# EasyEDA Pro project ProPrj_火灾检测装置_2025-07-03.epro

# Schematic Schematic1
Board Name: Board1; Create Date: 2025-06-30; Page Name: P1; Project Name: 火灾检测装置; Schematic Name: Schematic1; Update Date: 2025-07-02; Company: 嘉立创EDA; Page Size: A4; Version: V1.0
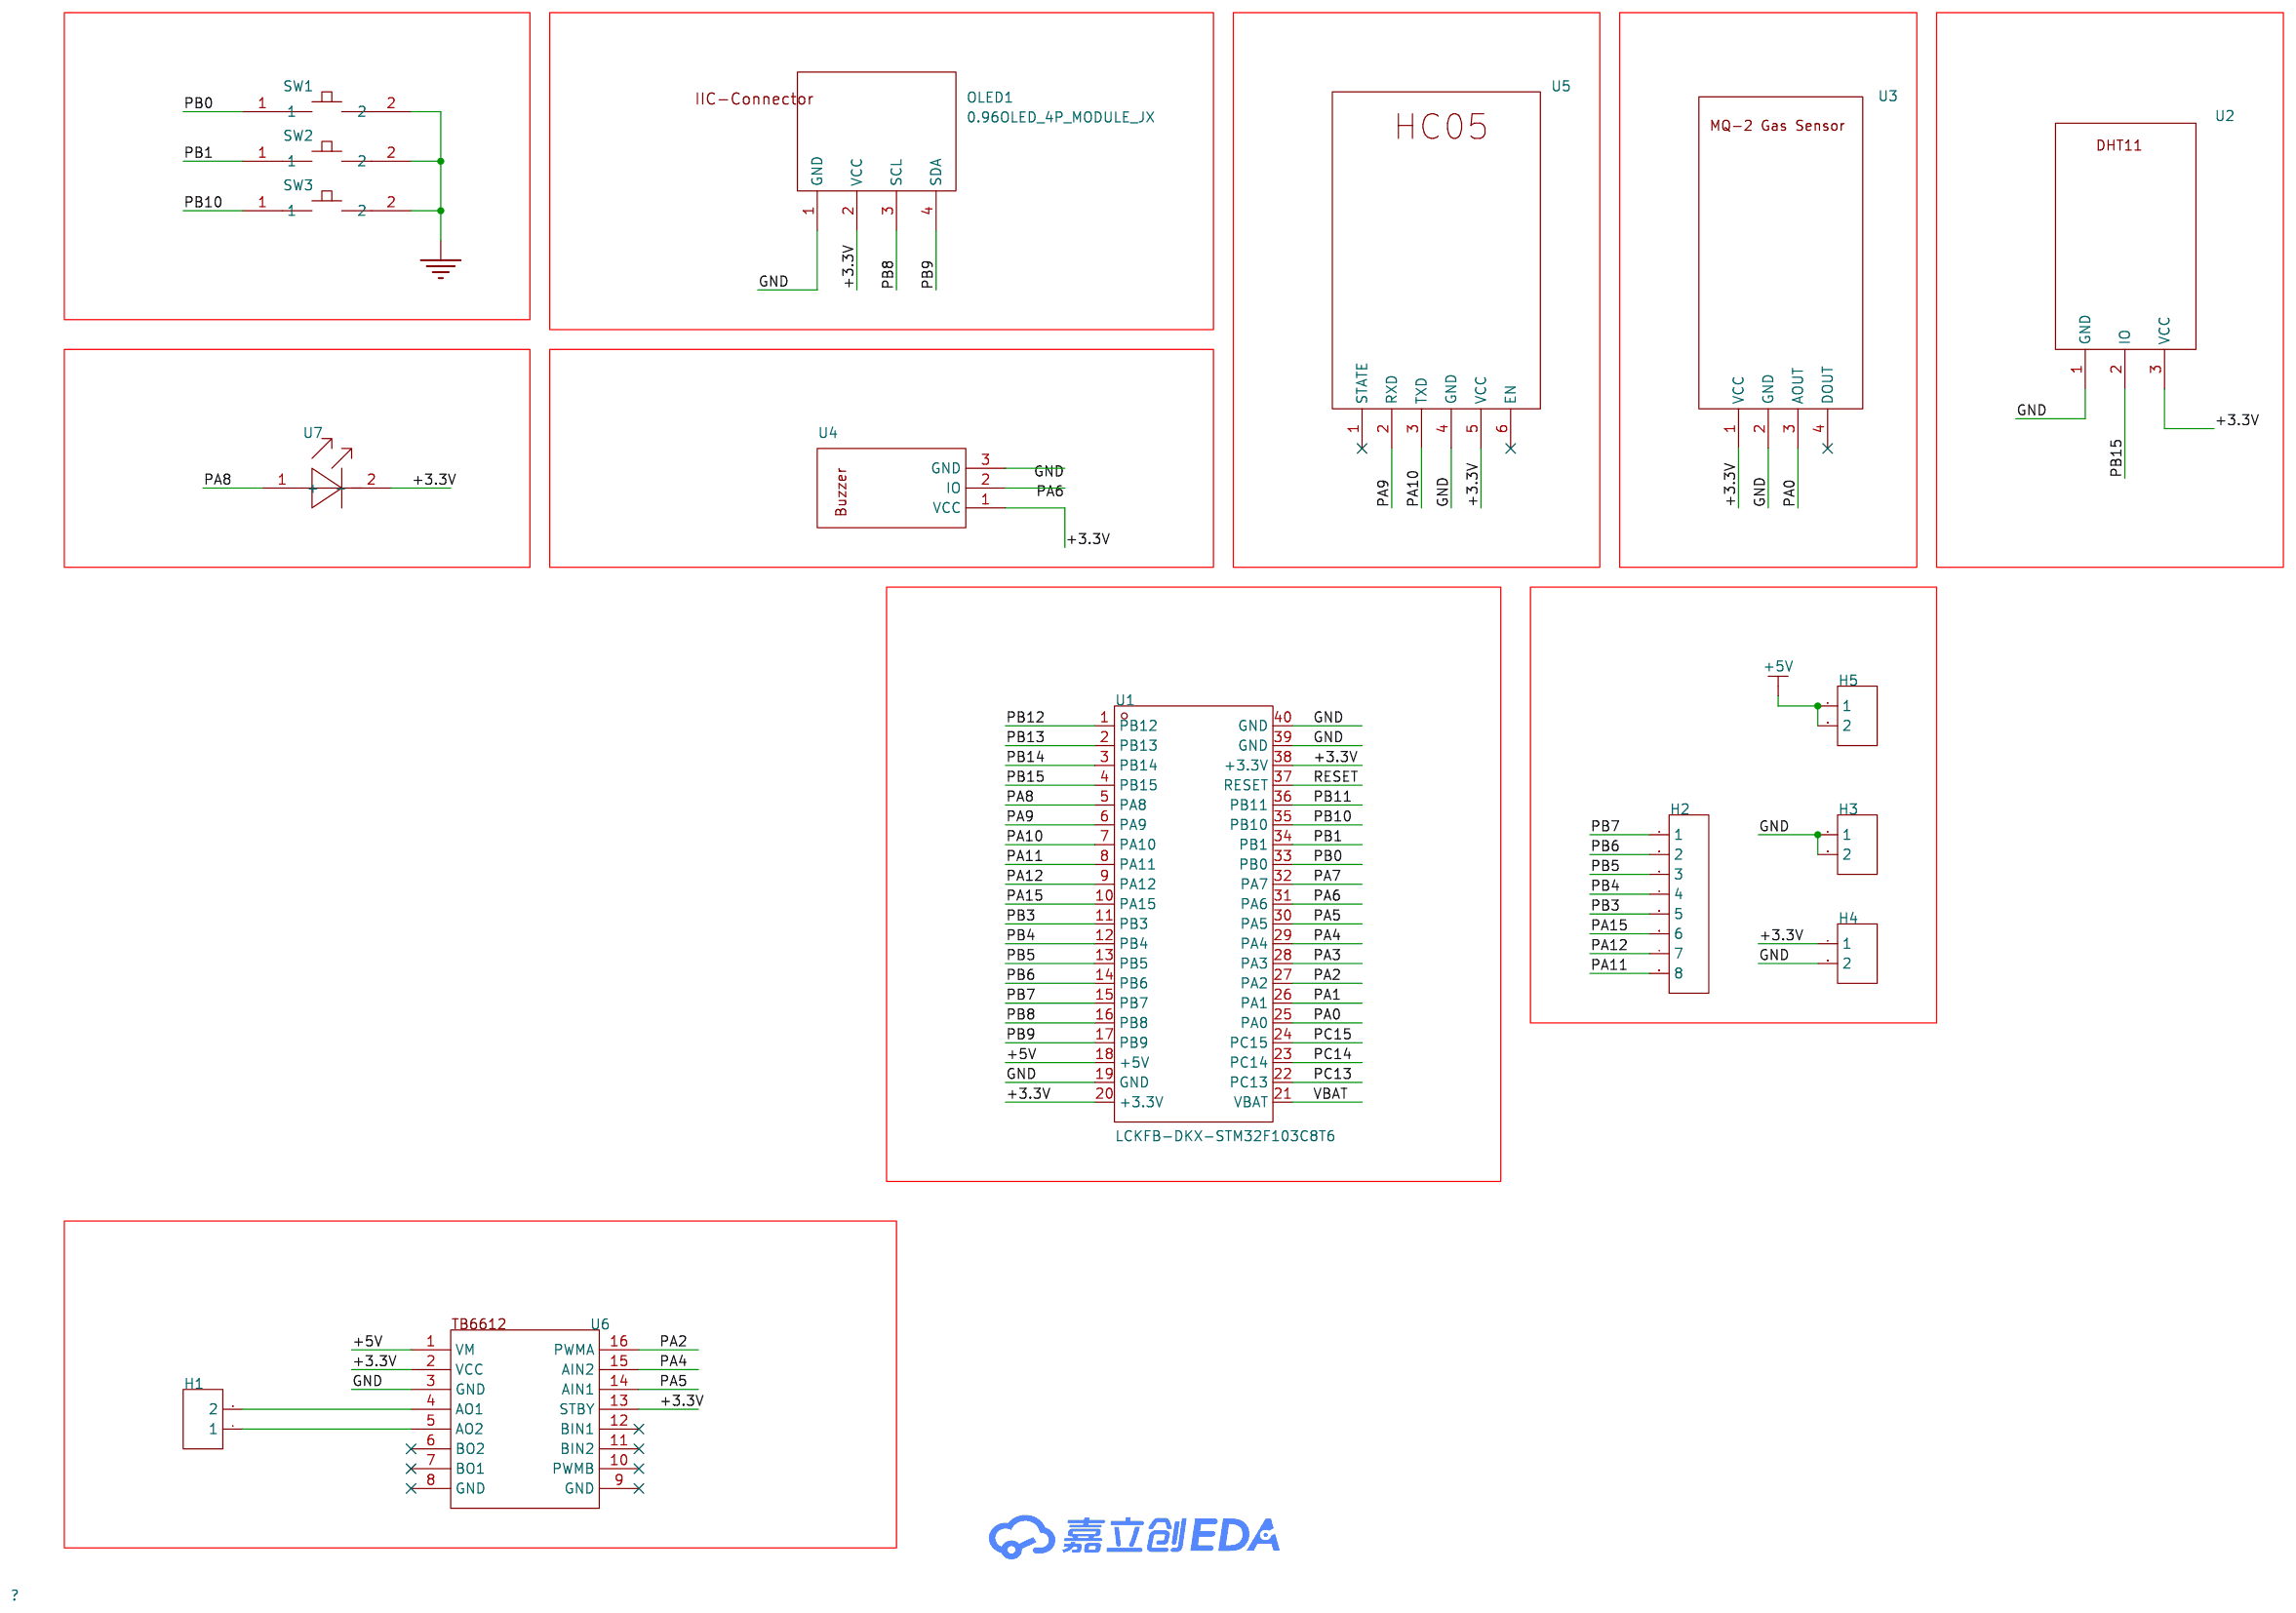
[diagram p0: schematic sheet]

## Parts
H1  -  [HDR-TH_2P-P2.54-V-F]
H2  -  [HDR-TH_8P-P2.54-V-F-1]
H3  -  [HDR-TH_2P-P2.54-V-F]
H4  -  [HDR-TH_2P-P2.54-V-F]
H5  -  [HDR-TH_2P-P2.54-V-F]
OLED1  0.96OLED_4P_MODULE_JX  [0.96OLED_4P]
SW1  -  [按键]
SW2  -  [按键]
SW3  -  [按键]
U1  LCKFB-DKX-STM32F103C8T6  [CONN-TH_L53.3-W22.9_STM32F103C8T6-CARD]
U2  -  [DHT11.]
U3  -  [MQ-2 Gas Sensor]
U4  -  [Buzzer]
U5  -  [HC05]
U6  -  [TB6612]
U7  -  [LED]

## Library data of the parts
H1 H3-H5 = HDR-F_2.54_1x2P: Supplier Part: C49661; Supplier Footprint: 插件
H2 = HDR-F_2.54_1x8P: Supplier Part: C27438; Supplier Footprint: 插件
OLED1 = 0.96OLED_4P_MODULE_JX: Supplier Part: C9900004566; Supplier Footprint: 插件; JLCPCB Part Class: 扩展库; Supplier: LCSC
SW1-SW3 = 按键
U1 = LCKFB-DKX-STM32F103C8T6: LCSC Part Name: 立创·地阔星-STM32F103C8T6开发板; Supplier Part: C22396880; Manufacturer: 立创开发板; JLCPCB Part Class: 扩展库; Datasheet: https://atta.szlcsc.com/upload/public/pdf/source/20241206/D7467B743BEDB0C7B9E08FA0EBB7E773.pdf; Supplier: LCSC
U2 = DHT11
U3 = MQ-2 Gas Sensor
U4 = Buzzer
U5 = HC05
U6 = TB6612
U7 = LED

## Nets
+3.3V: H4.1 OLED1.2(VCC) U1.20(+3.3V) U1.38(+3.3V) U2.3(VCC) U3.1(VCC) U4.1(VCC) U5.5(VCC) U6.2(VCC) U6.13(STBY) U7.2(-)
+5V: H5.1 H5.2 U1.18(+5V) U6.1(VM)
GND: H3.1 H3.2 H4.2 OLED1.1(GND) SW1.2 SW2.2 SW3.2 U1.19(GND) U1.39(GND) U1.40(GND) U2.1(GND) U3.2(GND) U4.3(GND) U5.4(GND) U6.3(GND)
VBAT: U1.21(VBAT)
PA0: U1.25(PA0) U3.3(AOUT)
PA1: U1.26(PA1)
PA2: U1.27(PA2) U6.16(PWMA)
PA3: U1.28(PA3)
PA4: U1.29(PA4) U6.15(AIN2)
PA5: U1.30(PA5) U6.14(AIN1)
PA6: U1.31(PA6) U4.2(IO)
PA7: U1.32(PA7)
PA8: U1.5(PA8) U7.1(+)
PA9: U1.6(PA9) U5.2(RXD)
PA10: U1.7(PA10) U5.3(TXD)
PA11: H2.8 U1.8(PA11)
PA12: H2.7 U1.9(PA12)
PA15: H2.6 U1.10(PA15)
PB0: SW1.1 U1.33(PB0)
PB1: SW2.1 U1.34(PB1)
PB3: H2.5 U1.11(PB3)
PB4: H2.4 U1.12(PB4)
PB5: H2.3 U1.13(PB5)
PB6: H2.2 U1.14(PB6)
PB7: H2.1 U1.15(PB7)
PB8: OLED1.3(SCL) U1.16(PB8)
PB9: OLED1.4(SDA) U1.17(PB9)
PB10: SW3.1 U1.35(PB10)
PB11: U1.36(PB11)
PB12: U1.1(PB12)
PB13: U1.2(PB13)
PB14: U1.3(PB14)
PB15: U1.4(PB15) U2.2(IO)
PC13: U1.22(PC13)
PC14: U1.23(PC14)
PC15: U1.24(PC15)
RESET: U1.37(RESET)
$1N2776: H1.2 U6.4(AO1)
$1N2780: H1.1 U6.5(AO2)

Not connected (* = marked no-connect by the designer): U3 4(DOUT)*; U5 1(STATE)* 6(EN)*; U6 6(BO2)* 7(BO1)* 8(GND)* 9(GND)* 10(PWMB)* 11(BIN2)* 12(BIN1)*

# Board PCB1
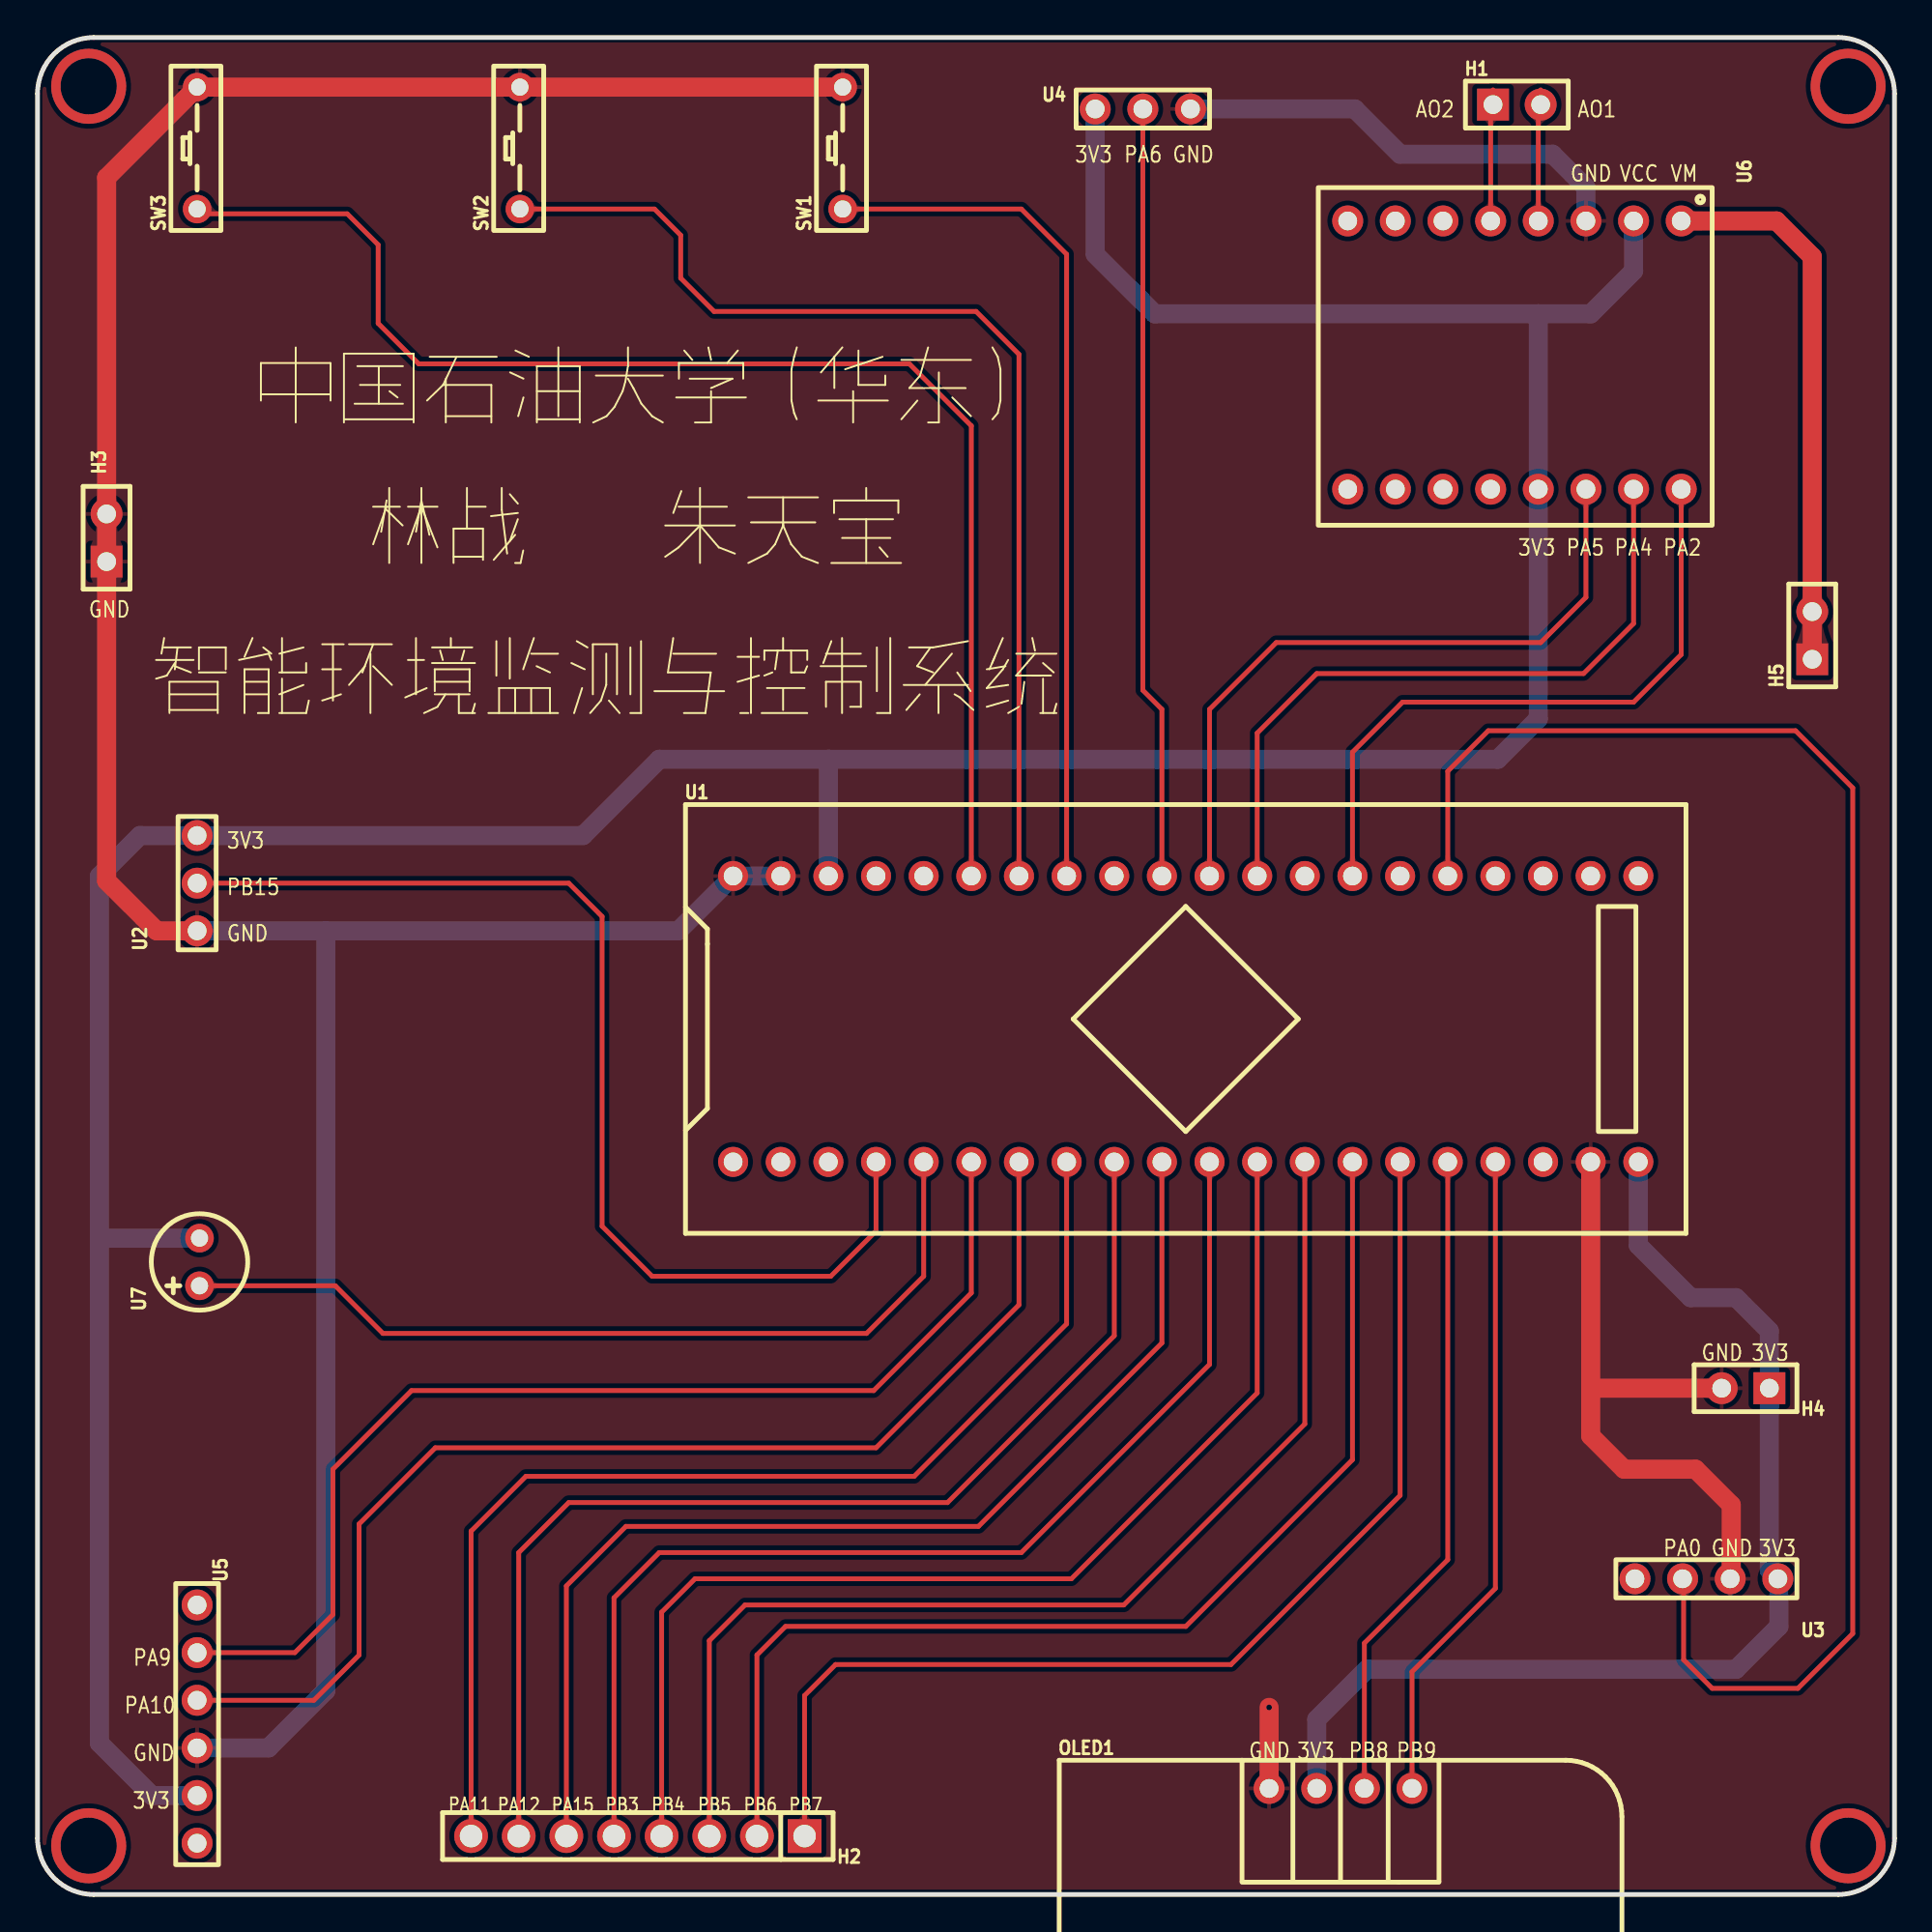
[diagram p1: board, top side]
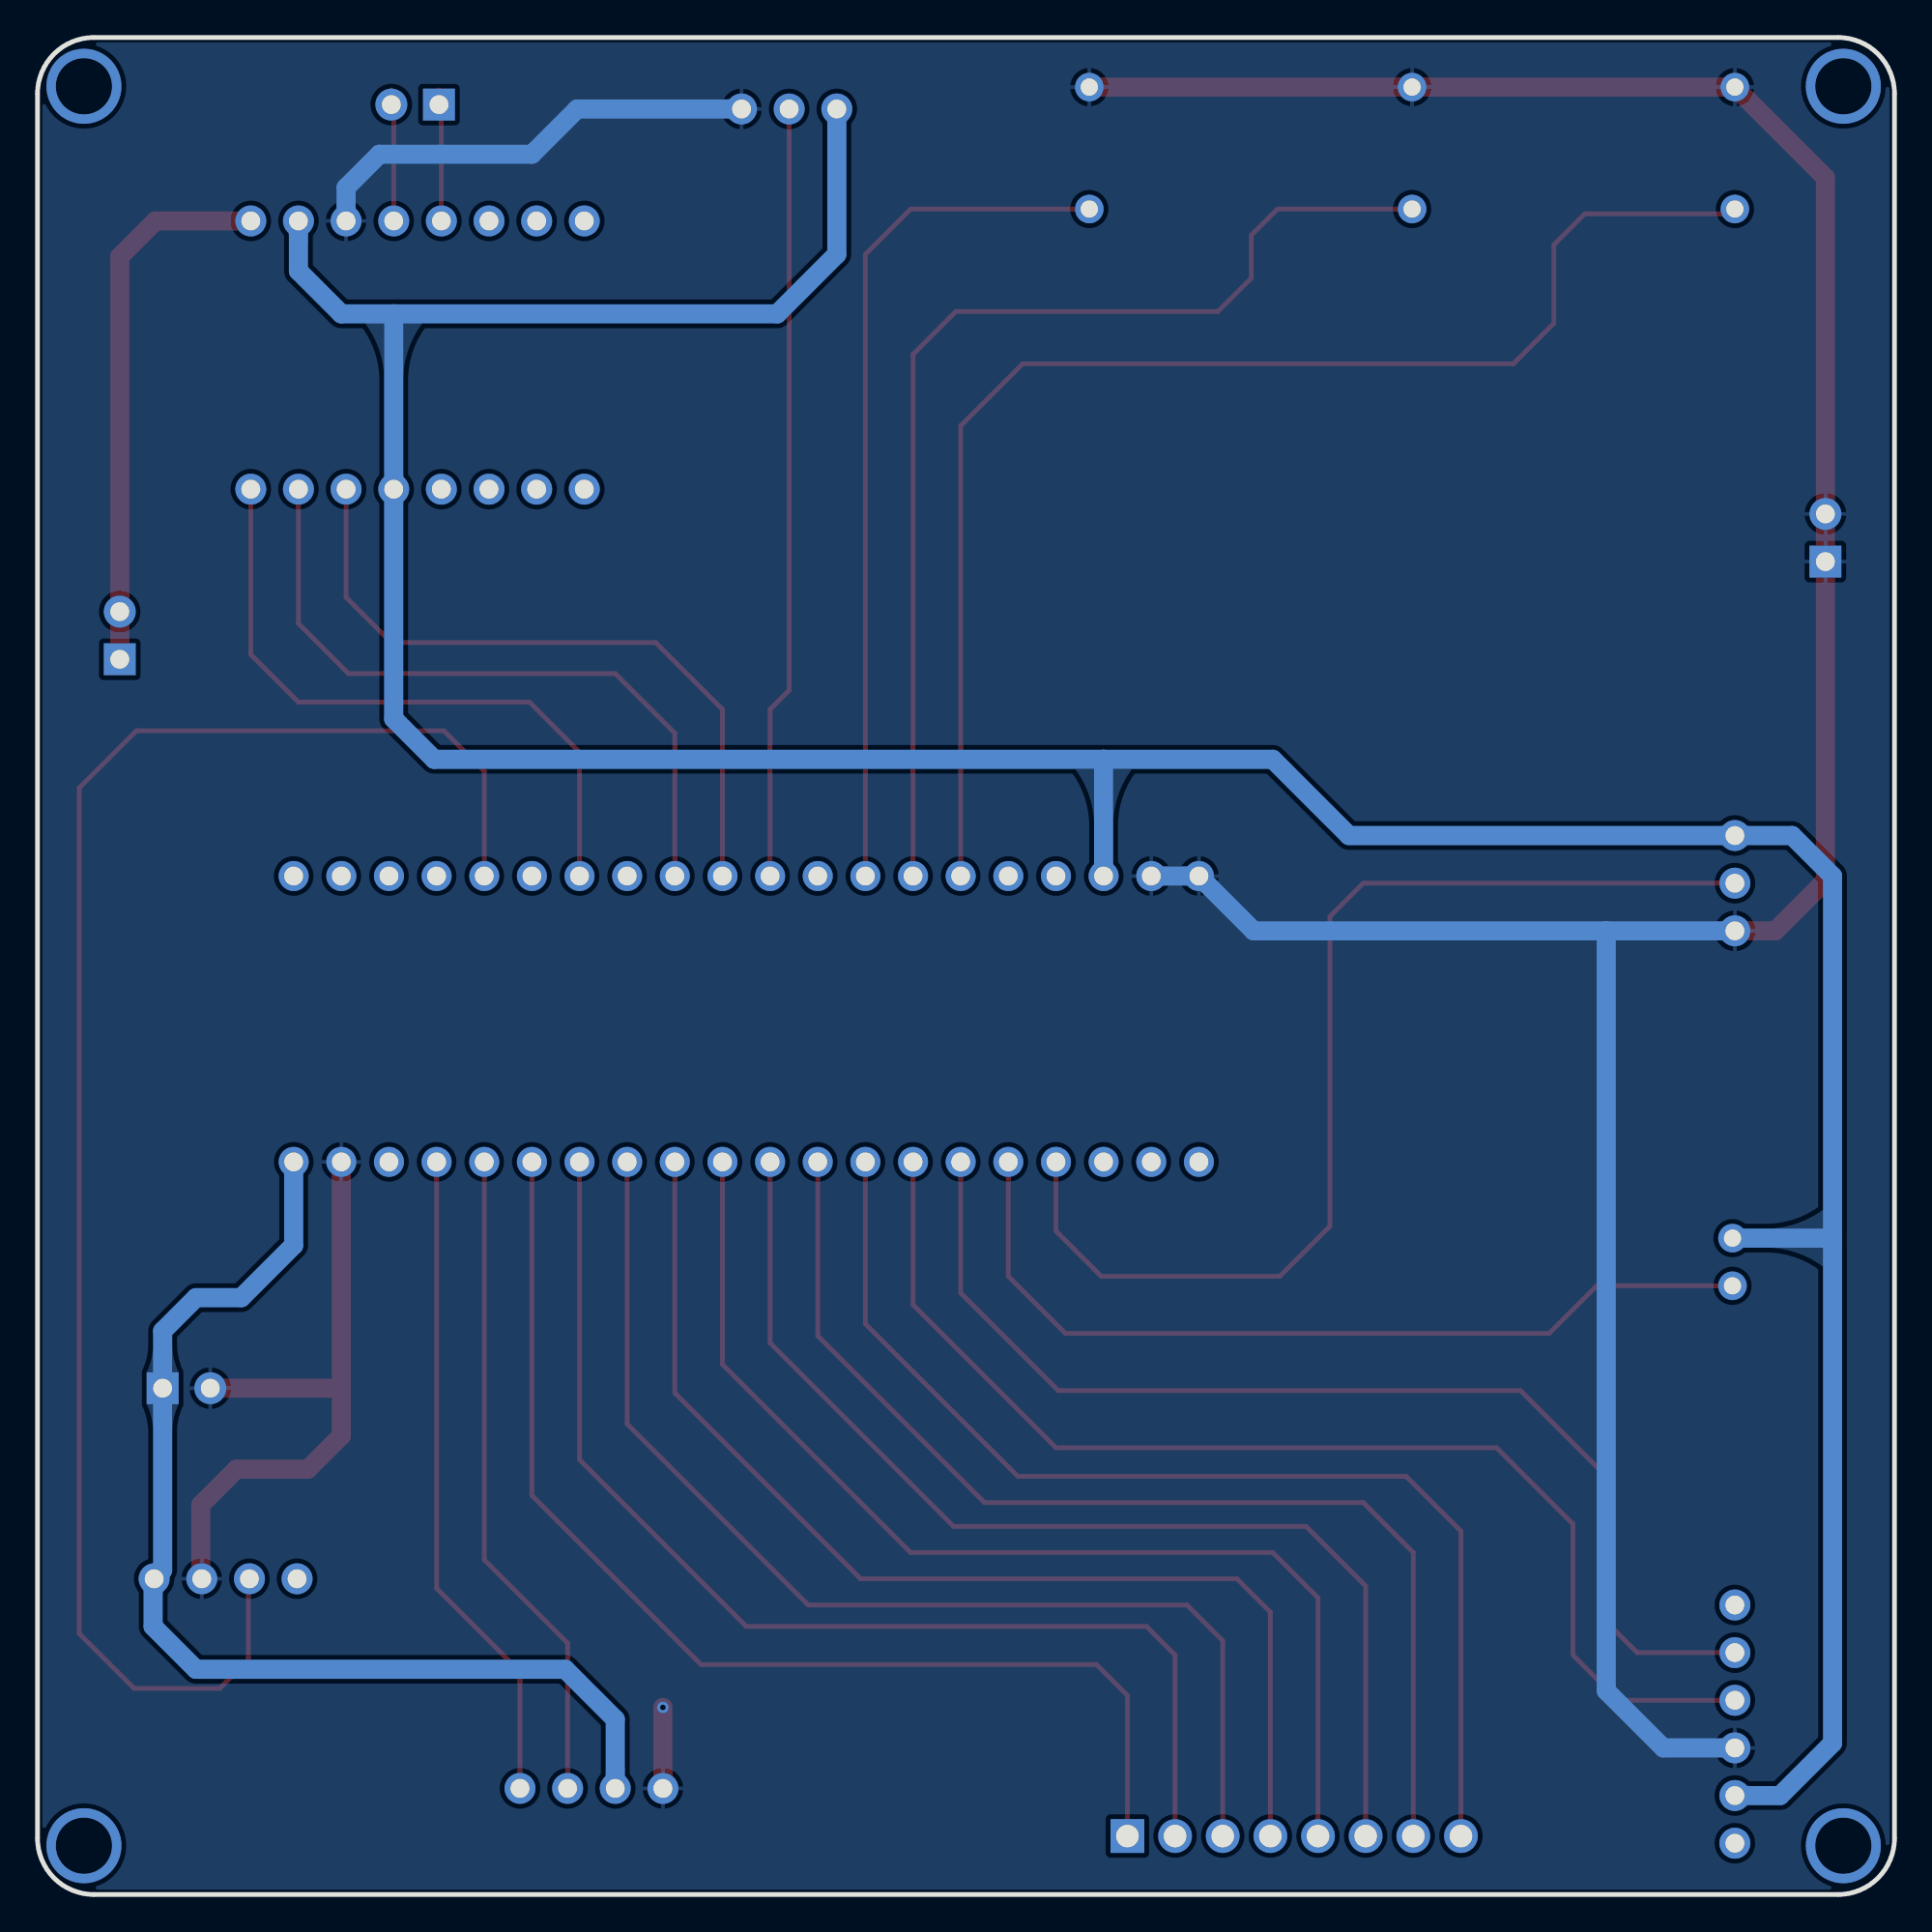
[diagram p2: board, bottom side, seen from below]

Outline 99 x 99 mm; copper layers: Top Layer, Bottom Layer. Coordinates in mm from the lower left corner of the outline.
Outline path: 0,96 0,3 arc(0.88,0.88) 3,0 96,0 arc(98.12,0.88) 99,3 99,96 arc(98.12,98.12) 96,99 3,99 arc(0.88,98.12) 0,96
Stack: Top Layer 0.035mm / Dielectric1 1.51mm FR4 er 4.5 / Bottom Layer 0.035mm

## Design rules (mm)
template: JLCPCB Capability(Two Layers Board)
spacing copperThickness1oz (default): track to track 0.102, other pairs 0.152 to 0.3
spacing copperThickness2oz: track to track 0.203, other pairs 0.152 to 0.3
track width copperThickness1oz (default): min 0.127, default 0.254, max 2.54
track width copperThickness2oz: min 0.203, default 0.254, max 2.54
differential pair differentialPair (default): width min 0.127, default 0.254, max 2.54; gap min 0.152, default 0.152
via viaSize (default): diameter min 0.5, default 0.61, max 10; hole min 0.3, default 0.305, max 6.3

## Placement (name value [footprint] x y rotation side)
H1  -  [HDR-TH_2P-P2.54-V-F]  78.87 95.42 0 top
H2  -  [HDR-TH_8P-P2.54-V-F-1]  32 3.12 180 top
H3  -  [HDR-TH_2P-P2.54-V-F]  3.68 72.33 90 top
H4  -  [HDR-TH_2P-P2.54-V-F]  91.06 26.99 180 top
H5  -  [HDR-TH_2P-P2.54-V-F]  94.61 67.12 90 top
OLED1  0.96OLED_4P_MODULE_JX  [0.96OLED_4P]  69.47 5.66 0 top
SW1  -  [按键]  42.93 89.86 90 top
SW2  -  [按键]  25.72 89.86 90 top
SW3  -  [按键]  8.51 89.86 90 top
U1  LCKFB-DKX-STM32F103C8T6  [CONN-TH_L53.3-W22.9_STM32F103C8T6-CARD]  61.21 46.68 0 top
U2  -  [DHT11.]  8.51 51.38 90 top
U3  -  [MQ-2 Gas Sensor]  92.78 16.83 180 top
U4  -  [Buzzer]  56.39 95.19 0 top
U5  -  [HC05]  8.51 15.43 270 top
U6  -  [TB6612]  87.63 89.22 270 top
U7  -  [LED]  8.64 32.45 90 top

## Footprints (pads in the part's own frame, mm; a bottom-side part is the same pattern mirrored in y, then rotated)
0.96OLED_4P
  round 1.65 hole 1: 1(-3.81,-0.002) 2(-1.27,0.002) 3(1.27,0.002) 4(3.81,0.002)
Buzzer
  round 1.65 hole 1: 1(0,0) 2(2.54,0) 3(5.08,0)
CONN-TH_L53.3-W22.9_STM32F103C8T6-CARD
  round 1.6 hole 1: 1(-24.13,-7.62) 2(-21.59,-7.62) 3(-19.05,-7.62) 4(-16.51,-7.62) 5(-13.97,-7.62) 6(-11.43,-7.62) 7(-8.89,-7.62) 8(-6.35,-7.62) 9(-3.81,-7.62) 10(-1.27,-7.62) 11(1.27,-7.62) 12(3.81,-7.62) 13(6.35,-7.62) 14(8.89,-7.62) 15(11.43,-7.62) 16(13.97,-7.62) 17(16.51,-7.62) 18(19.05,-7.62) 19(21.59,-7.62) 20(24.13,-7.62) 21(24.13,7.62) 22(21.59,7.62) 23(19.05,7.62) 24(16.51,7.62) 25(13.97,7.62) 26(11.43,7.62) 27(8.89,7.62) 28(6.35,7.62) 29(3.81,7.62) 30(1.27,7.62) 31(-1.27,7.62) 32(-3.81,7.62) 33(-6.35,7.62) 34(-8.89,7.62) 35(-11.43,7.62) 36(-13.97,7.62) 37(-16.51,7.62) 38(-19.05,7.62) 39(-21.59,7.62) 40(-24.13,7.62)
DHT11.
  round 1.65 hole 1.001: 1(0,0) 2(2.54,0) 3(5.08,0)
HC05
  round 1.65 hole 1: 1(0,0) 2(2.54,0) 3(5.08,0) 4(7.62,0) 5(10.16,0) 6(12.7,0)
HDR-TH_2P-P2.54-V-F
  rect 1.7x1.7 hole 1: 1(-1.27,0)
  round 1.7 hole 1: 2(1.27,0)
HDR-TH_8P-P2.54-V-F-1
  rect 1.8x1.8 hole 1.2: 1(-8.89,0)
  round 1.8 hole 1.2: 2(-6.35,0) 3(-3.81,0) 4(-1.27,0) 5(1.27,0) 6(3.81,0) 7(6.35,0) 8(8.89,0)
LED
  round 1.524 hole 0.914x0.6: 1(0,0) 2(2.54,0)
MQ-2 Gas Sensor
  round 1.65 hole 1: 1(0,0) 2(2.54,0) 3(5.08,0) 4(7.62,0)
TB6612
  round 1.65 hole 1: 1(0,0) 2(0,-2.54) 3(0,-5.08) 4(0,-7.62) 5(0,-10.16) 6(0,-12.7) 7(0,-15.24) 8(0,-17.78) 9(14.3,-17.78) 10(14.3,-15.24) 11(14.3,-12.7) 12(14.3,-10.16) 13(14.3,-7.62) 14(14.3,-5.08) 15(14.3,-2.54) 16(14.3,0)
按键
  round 1.524 hole 0.914x0.8: 1(0,0) 2(6.5,0)

## Nets
As in the schematic.

Pads without a net: U3 4; U5 1 6; U6 6 7 8 9 10 11 12

## Via types
v1: diameter 4, hole 3, Top Layer to Bottom Layer, 4 vias
v2: diameter 0.61, hole 0.305, Top Layer to Bottom Layer, 1 via

## Routing (per net, layer and track width the routed paths; a pad name or vN(x,y) marks a point on that pad's centre or on a via; arc(x,y) is an arc through that point)
+3.3V: length 267
  Bottom Layer w1.016: U4.1 56.39,87.44 59.56,84.27 80.01,84.27 ; 42.16,60.52 77.85,60.52 80.01,62.68 80.01,84.27 ; 42.16,60.52 33.15,60.52 29.08,56.45 U2.3 5.46,56.45 3.3,54.3 3.3,34.86 ; 42.16,60.52 U1.38 ; U5.5 6.1,5.27 3.3,8.07 3.3,34.86 ; 3.3,34.86 3.43,34.99 U7.2 ; 80.01,84.27 82.8,84.27 85.09,86.55 U6.2 ; U1.20 85.34,34.61 88.14,31.82 90.55,31.82 92.33,30.04 H4.1 92.33,17.28 U3.1 92.84,16.78 92.84,14.29 90.55,12 70.87,12 68.2,9.34 OLED1.2
+5V: length 29.2
  Top Layer w1.016: 94.61,65.85 H5.2 94.61,87.32 92.71,89.22 U6.1
GND: length 229.1
  Top Layer w1.016: H4.2 82.86,26.99 82.8,27.05 ; 82.8,27.05 U1.19 ; 82.8,27.05 82.8,24.45 84.58,22.67 88.39,22.67 90.3,20.77 90.3,16.88 U3.2 ; SW1.2 SW2.2 SW3.2 3.68,91.53 H3.2 H3.1 3.68,54.04 6.35,51.38 U2.1 ; OLED1.1 v2(65.66,9.97)
  Bottom Layer w1.016: U2.1 15.37,51.38 ; 15.37,51.38 15.37,10.86 12.32,7.81 U5.4 ; 15.37,51.38 34.16,51.38 U1.40 U1.39 ; 82.55,89.22 82.55,91 80.77,92.78 72.64,92.78 70.23,95.19 U4.3
(no net):
  vias: v1(2.73,96.4) v1(2.73,2.6) v1(96.53,96.4) v1(96.53,2.6)
PA0: length 89.7
  Top Layer w0.254: 87.76,16.88 87.76,12.51 89.28,10.99 93.85,10.99 96.77,13.91 96.77,59 93.73,62.04 77.34,62.04 75.18,59.88 U1.25 ; 87.76,16.88 87.76,16.9 ; 87.76,16.88 U3.3
PA2: length 35.1
  Top Layer w0.254: U1.27 70.1,60.9 72.77,63.57 85.09,63.57 87.63,66.11 U6.16
PA4: length 37.3
  Top Layer w0.254: U6.15 85.09,67.76 82.42,65.09 68.2,65.09 65.02,61.92 U1.29
PA5: length 37.2
  Top Layer w0.254: U1.30 62.48,63.19 66.04,66.74 80.14,66.74 82.55,69.16 82.55,74.92
PA6: length 41.3
  Top Layer w0.254: U4.2 58.93,64.2 59.94,63.19 U1.31
PA8: length 47
  Top Layer w0.254: U7.1 15.88,32.45 18.41,29.91 44.2,29.91 47.24,32.96 U1.5
PA9: length 60.7
  Top Layer w0.254: U1.6 49.78,32.07 44.58,26.86 19.94,26.86 15.75,22.67 15.75,14.93 13.72,12.89 U5.2
PA10: length 64.3
  Top Layer w0.254: U1.7 52.32,31.44 44.7,23.82 21.21,23.82 17.14,19.75 17.14,12.77 14.73,10.35 U5.3
PA11: length 61.2
  Top Layer w0.254: U1.8 54.86,30.42 46.74,22.29 26.03,22.29 23.11,19.37 H2.8
PA12: length 60.9
  Top Layer w0.254: U1.9 57.4,29.78 48.51,20.9 28.32,20.9 25.65,18.23 H2.7
PA15: length 60.1
  Top Layer w0.254: H2.6 28.19,16.45 31.37,19.62 50.17,19.62 59.94,29.4 U1.10
PB0: length 46.1
  Top Layer w0.254: SW1.1 52.45,89.86 54.86,87.44 U1.33
PB1: length 59
  Top Layer w0.254: U1.34 52.32,82.11 50.04,84.39 36.07,84.39 34.29,86.17 34.29,88.46 32.89,89.86 SW2.1
PB3: length 60.4
  Top Layer w0.254: U1.11 62.48,28.26 52.45,18.23 33.15,18.23 30.73,15.81 H2.5
PB4: length 60.8
  Top Layer w0.254: U1.12 65.02,26.74 55.12,16.83 35.05,16.83 33.27,15.05 H2.4
PB5: length 60.9
  Top Layer w0.254: H2.3 35.81,13.53 37.72,15.43 57.91,15.43 67.56,25.09 U1.13
PB6: length 61.6
  Top Layer w0.254: U1.14 70.1,23.18 61.21,14.29 39.88,14.29 38.35,12.77 H2.2
PB7: length 61.4
  Top Layer w0.254: U1.15 72.64,21.28 63.63,12.26 42.55,12.26 40.89,10.61 H2.1
PB8: length 35.2
  Top Layer w0.254: U1.16 75.18,17.85 70.74,13.4 OLED1.3
PB9: length 35.2
  Top Layer w0.254: OLED1.4 73.28,11.88 77.72,16.32 U1.17
PB10: length 72.4
  Top Layer w0.254: 8.51,89.6 16.51,89.6 18.16,87.95 18.16,83.76 20.32,81.6 46.48,81.6 49.78,78.3 U1.35
PB15: length 59.2
  Top Layer w0.254: U1.4 44.7,35.37 42.29,32.96 32.77,32.96 30.1,35.63 30.1,52.14 28.32,53.92 U2.2
$1N2776: length 7
  Top Layer w0.254: 80.14,96.21 80.01,96.08 80.01,89.22
$1N2780: length 7
  Top Layer w0.254: 77.6,96.21 77.47,96.08 U6.5

## Copper pours and planes (outline as drawn; the poured copper is in the pictures)
GND on Top Layer: -15.37,107.76 118.11,107.76 118.11,-29.65 -15.37,-29.65
GND on Bottom Layer: -17.65,106.75 116.59,106.75 116.59,-28 -17.65,-28

Small or netless copper shapes (teardrops, artwork), in the pictures only: 67 on Top Layer, 26 on Bottom Layer

## Text on the board
Top Silkscreen Layer: PA11 | PA12 | PA15 | PB3 | PB4 | PB5 | PB6 | PB7 | GND | PA10 | 3V3 | PA9 | PB15 | PA6 | PB8 | PB9 | AO2 | PA5 | AO1 | PA4 | VCC | PA2 | PA0 | VM | 智能环境监测与控制系统 | 中国石油大学（华东） | 林战   朱天宝
